# Altium schematic sheet Batarey.SchDoc
size A1; SheetNumber: 1; SheetTotal: 1
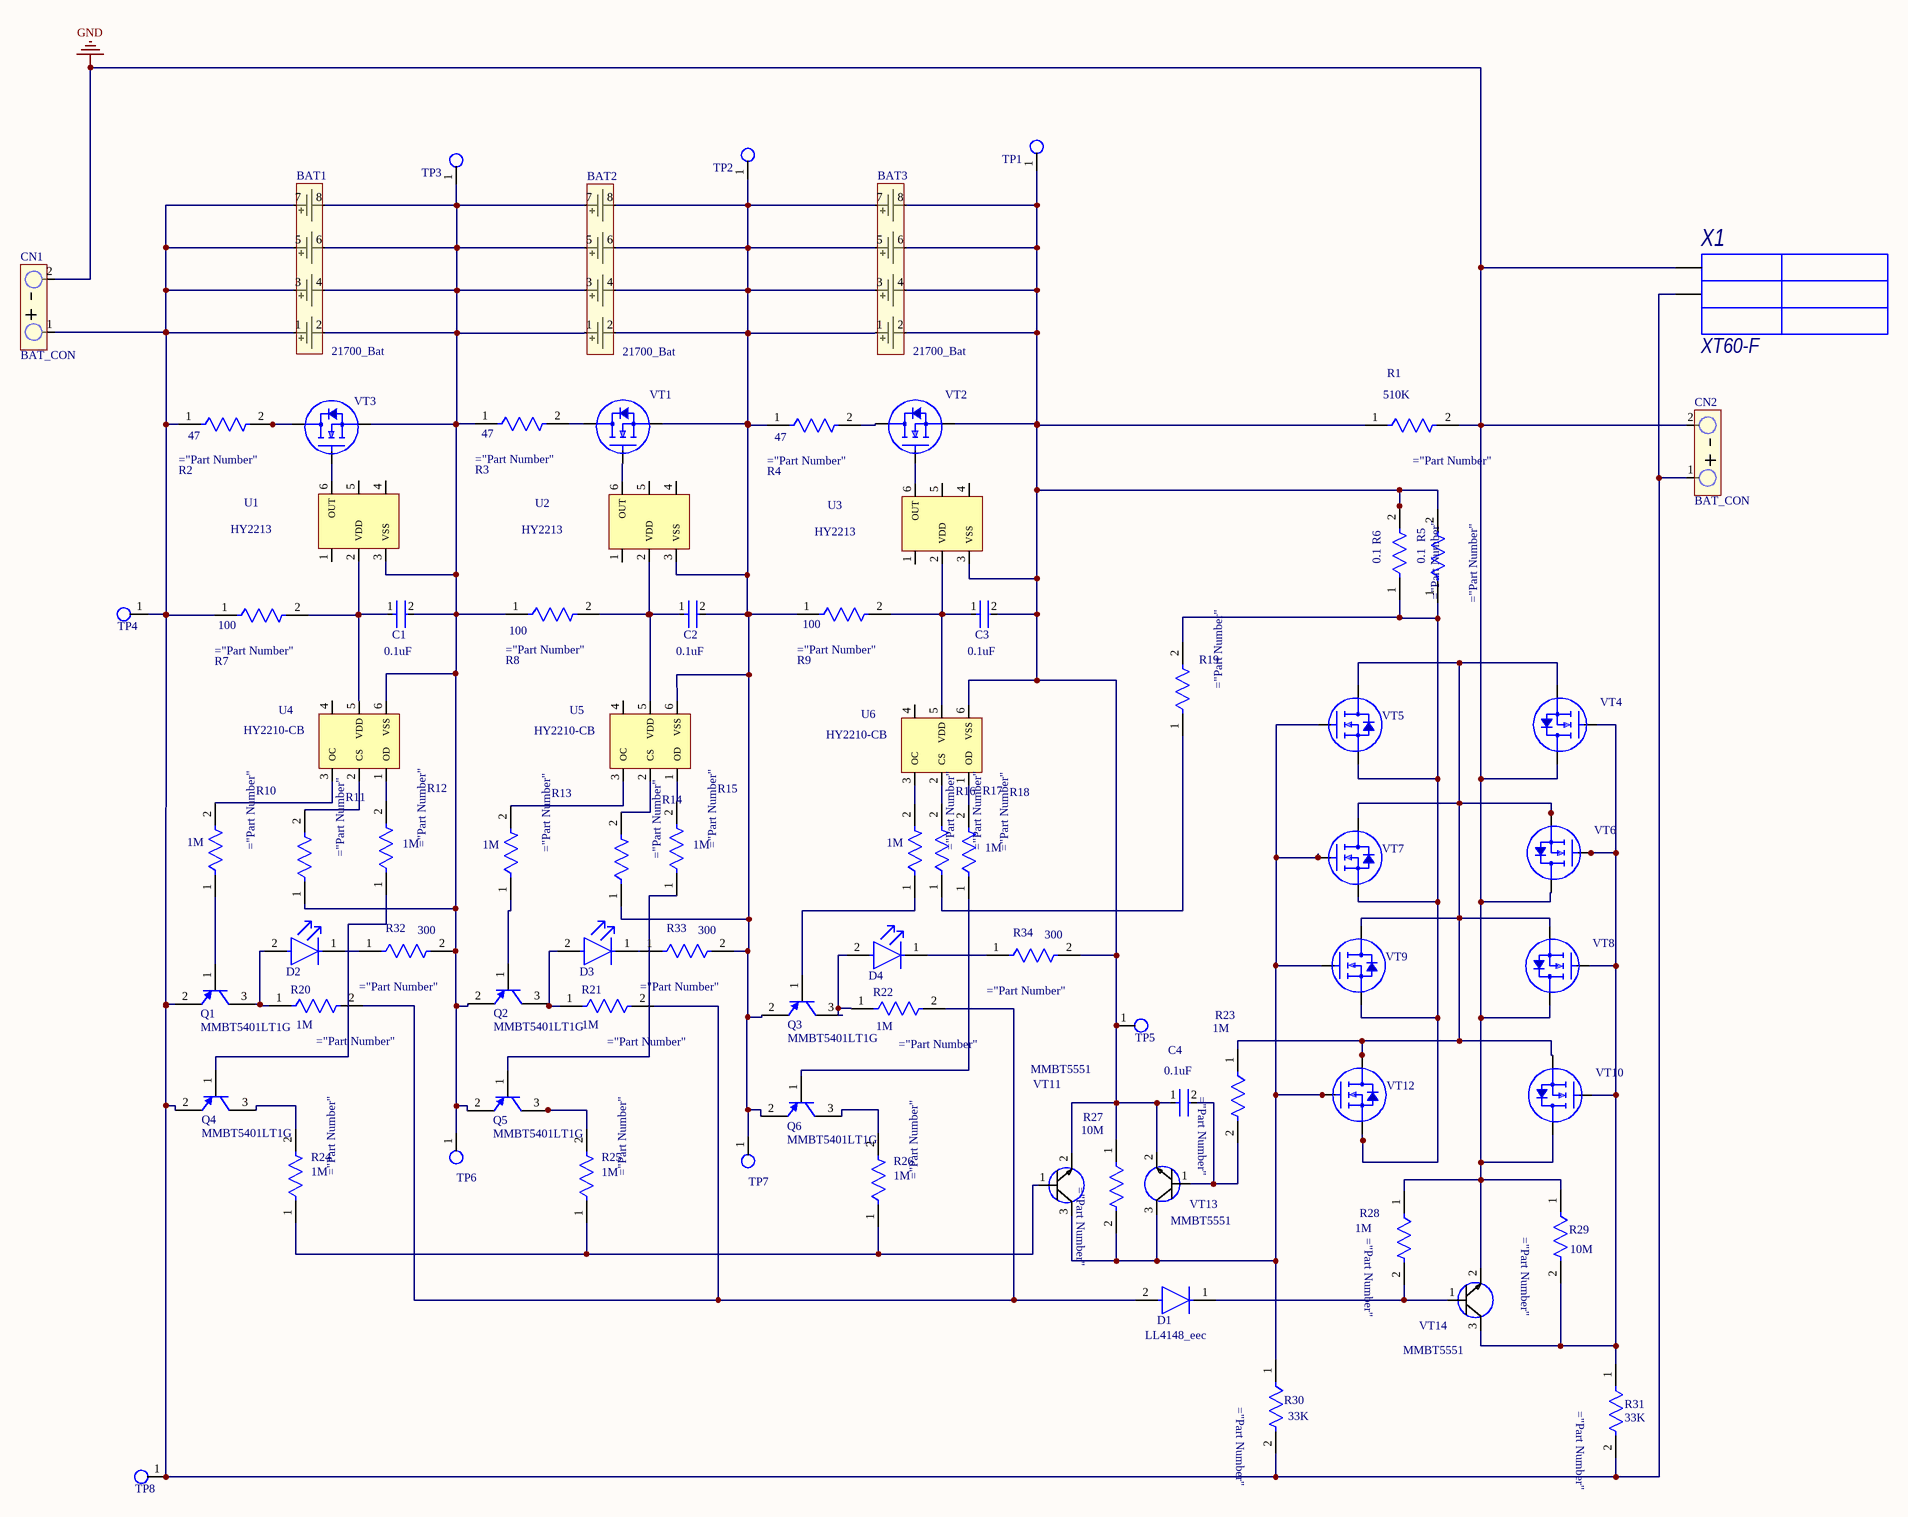
[diagram p0: Batarey.SchDoc]

## Parts
BAT1  21700_Bat  [21700_BAT]
BAT2  21700_Bat  [21700_BAT]
BAT3  21700_Bat  [21700_BAT]
C1  0.1uF  [C-0805]
C2  0.1uF  [C-0805]
C3  0.1uF  [C-0805]
C4  0.1uF  [C-0805]
CN1  BAT_CON  [Batarey_connector]
CN2  BAT_CON  [Batarey_connector]
D1  LL4148_eec  [1N4148WT7]
D2  150080SS75000  [LED-0805B]  (value not drawn)
D3  150080SS75000  [LED-0805B]  (value not drawn)
D4  150080SS75000  [LED-0805B]  (value not drawn)
Q1  MMBT5401LT1G  [ONSC-SOT-23-3-318-08_V]
Q2  MMBT5401LT1G  [ONSC-SOT-23-3-318-08_V]
Q3  MMBT5401LT1G  [ONSC-SOT-23-3-318-08_V]
Q4  MMBT5401LT1G  [ONSC-SOT-23-3-318-08_V]
Q5  MMBT5401LT1G  [ONSC-SOT-23-3-318-08_V]
Q6  MMBT5401LT1G  [ONSC-SOT-23-3-318-08_V]
R1  510K  [R-0805]
R2  47  [TE_Connectivity_CRGCQ1210_IPC_A]
R3  47  [TE_Connectivity_CRGCQ1210_IPC_A]
R4  47  [TE_Connectivity_CRGCQ1210_IPC_A]
R5  0.1  [TE_Connectivity_CRGCQ1210_IPC_A]
R6  0.1  [TE_Connectivity_CRGCQ1210_IPC_A]
R7  100  [TE_Connectivity_CRGCQ1210_IPC_A]
R8  100  [TE_Connectivity_CRGCQ1210_IPC_A]
R9  100  [TE_Connectivity_CRGCQ1210_IPC_A]
R10  1M  [R-0805]
R11  RC0805FR-07100KL  [R-0805]  (value not drawn)
R12  1M  [R-0805]
R13  1M  [R-0805]
R14  RC0805FR-07100KL  [R-0805]  (value not drawn)
R15  1M  [R-0805]
R16  1M  [R-0805]
R17  RC0805FR-07100KL  [R-0805]  (value not drawn)
R18  1M  [R-0805]
R19  1K  [R-0805]  (value not drawn)
R20  1M  [R-0805]
R21  1M  [R-0805]
R22  1M  [R-0805]
R23  1M  [R-0805]
R24  1M  [R-0805]
R25  1M  [R-0805]
R26  1M  [R-0805]
R27  10M  [R-0805]
R28  1M  [R-0805]
R29  10M  [R-0805]
R30  33K  [R-0805]
R31  33K  [R-0805]
R32  300  [R-0805]
R33  300  [R-0805]
R34  300  [R-0805]
TP1  Test_Point_PCB  [TEST_POINT_CONN]  (value not drawn)
TP2  Test_Point_PCB  [TEST_POINT_CONN]  (value not drawn)
TP3  Test_Point_PCB  [TEST_POINT_CONN]  (value not drawn)
TP4  Test_Point_PCB  [TEST_POINT_CONN]  (value not drawn)
TP5  Test_Point_PCB  [TEST_POINT_CONN]  (value not drawn)
TP6  Test_Point_PCB  [TEST_POINT_CONN]  (value not drawn)
TP7  Test_Point_PCB  [TEST_POINT_CONN]  (value not drawn)
TP8  Test_Point_PCB  [TEST_POINT_CONN]  (value not drawn)
U1  HY2213  [HY2213]
U2  HY2213  [HY2213]
U3  HY2213  [HY2213]
U4  HY2210-CB  [HY2213]
U5  HY2210-CB  [HY2213]
U6  HY2210-CB  [HY2213]
VT1  IPB60R600P6  [TO-263-3]  (value not drawn)
VT2  IPB60R600P6  [TO-263-3]  (value not drawn)
VT3  IPB60R600P6  [TO-263-3]  (value not drawn)
VT4  IPB60R600P6  [TO-263-3]  (value not drawn)
VT5  IPB60R600P6  [TO-263-3]  (value not drawn)
VT6  IPB60R600P6  [TO-263-3]  (value not drawn)
VT7  IPB60R600P6  [TO-263-3]  (value not drawn)
VT8  IPB60R600P6  [TO-263-3]  (value not drawn)
VT9  IPB60R600P6  [TO-263-3]  (value not drawn)
VT10  IPB60R600P6  [TO-263-3]  (value not drawn)
VT11  MMBT5551  [On_Semiconductor_318-08_IPC_A]
VT12  IPB60R600P6  [TO-263-3]  (value not drawn)
VT13  MMBT5551  [On_Semiconductor_318-08_IPC_A]
VT14  MMBT5551  [On_Semiconductor_318-08_IPC_A]
X1  XT60-F  [XT60-F AMASS]

## Nets
GND: CN1.2(-) CN2.2(-) R1.2 R28.1 R29.1 VT4.D VT6.D VT8.D VT10.D VT14.2(E) X1.2
NetBAT1_1: BAT1.1(+1S) BAT1.3(+2S) BAT1.5(+3S) BAT1.7(+4S) CN1.1(+) CN2.1(+) Q1.2(E) Q4.2(E) R2.1 R7.1 R30.2 R31.2 TP4.1(G9) TP8.1(G9) X1.1
NetBAT1_2: BAT1.2(-1S) BAT1.4(-2S) BAT1.6(-3S) BAT1.8(-4S) BAT2.1(+1S) BAT2.3(+2S) BAT2.5(+3S) BAT2.7(+4S) C1.2 Q2.2(E) Q5.2(E) R3.1 R8.1 R11.1 R32.2 TP3.1(G9) TP6.1(G9) U1.3(VSS) U4.6(VSS) VT3.S
NetBAT2_2: BAT2.2(-1S) BAT2.4(-2S) BAT2.6(-3S) BAT2.8(-4S) BAT3.1(+1S) BAT3.3(+2S) BAT3.5(+3S) BAT3.7(+4S) C2.2 Q3.2(E) Q6.2(E) R4.1 R9.1 R14.1 R33.2 TP2.1(G9) TP7.1(G9) U2.3(VSS) U5.6(VSS) VT1.S
NetBAT3_2: BAT3.2(-1S) BAT3.4(-2S) BAT3.6(-3S) BAT3.8(-4S) C3.2 C4.1 R1.1 R5.2 R6.2 R27.1 R34.2 TP1.1(G9) TP5.1(G9) U3.3(VSS) U6.6(VSS) VT2.S VT11.2(E) VT13.2(E)
NetC1_1: C1.1 R7.2 U1.2(VDD) U4.5(VDD)
NetC2_1: C2.1 R8.2 U2.2(VDD) U5.5(VDD)
NetC3_1: C3.1 R9.2 U3.2(VDD) U6.5(VDD)
NetC4_2: C4.2 R23.2 VT13.1(B)
NetD1_1: D1.1(C) R28.2 VT14.1(B)
NetD1_2: D1.2(A) R20.2 R21.2 R22.2
NetD2_1: D2.1(C) R32.1
NetD2_2: D2.2(A) Q1.3(C) R20.1
NetD3_1: D3.1(C) R33.1
NetD3_2: D3.2(A) Q2.3(C) R21.1
NetD4_1: D4.1(C) R34.1
NetD4_2: D4.2(A) Q3.3(C) R22.1
NetQ1_1: Q1.1(B) R10.1
NetQ2_1: Q2.1(B) R13.1
NetQ3_1: Q3.1(B) R16.1
NetQ4_1: Q4.1(B) R12.1
NetQ4_3: Q4.3(C) R24.2
NetQ5_1: Q5.1(B) R15.1
NetQ5_3: Q5.3(C) R25.2
NetQ6_1: Q6.1(B) R18.1
NetQ6_3: Q6.3(C) R26.2
NetR2_2: R2.2 VT3.D
NetR3_2: R3.2 VT1.D
NetR4_2: R4.2 VT2.D
NetR5_1: R5.1 R6.1 R19.2 VT5.S VT7.S VT9.S VT12.S
NetR10_2: R10.2 U4.3(OC)
NetR11_2: R11.2 U4.2(CS)
NetR12_2: R12.2 U4.1(OD)
NetR13_2: R13.2 U5.3(OC)
NetR14_2: R14.2 U5.2(CS)
NetR15_2: R15.2 U5.1(OD)
NetR16_2: R16.2 U6.3(OC)
NetR17_1: R17.1 R19.1
NetR17_2: R17.2 U6.2(CS)
NetR18_2: R18.2 U6.1(OD)
NetR23_1: R23.1 VT4.S VT5.D VT6.S VT7.D VT8.S VT9.D VT10.S VT12.D
NetR24_1: R24.1 R25.1 R26.1 VT11.1(B)
NetR27_2: R27.2 R30.1 VT5.G VT7.G VT9.G VT11.3(C) VT12.G VT13.3(C)
NetR29_2: R29.2 R31.1 VT4.G VT6.G VT8.G VT10.G VT14.3(C)
NetU1_6: U1.6(OUT) VT3.G
NetU2_6: U2.6(OUT) VT1.G
NetU3_6: U3.6(OUT) VT2.G

Not connected (* = marked no-connect by the designer): U1 1(47) 4 5; U2 1(47) 4 5; U3 1(47) 4 5; U4 4; U5 4; U6 4

## Library data of the parts
C1-C4 = C0805C224K5RACTU
CN1 CN2 = BAT_CON: Batarey_connection
D1 = Diode_Fairchild-ON_Semiconductor_LL4148_eec: DIODE GEN PURP 100V 200MA SOD80; Part Number: LL4148; Manufacturer: Fairchild/ON Semiconductor; Num Pins: 2; helpURL: https://upverter.com/upn/revision/7267ed481d20a817/; ComponentLink2Description: Datasheet; Temperature: -55°C to +175°C; Package: SOD80; Supplier 2: Mouser; Price: 0.0408687939508; Supplier 1: Digi-Key; ComponentLink1URL: https://upverter.com/upn/revision/7267ed481d20a817/; Supplier Part Number 2: 512-LL4148; Supplier Part Number 1: LL4148FSCT-ND; ComponentLink1Description: Upverter; ComponentLink2URL: https://www.fairchildsemi.com/datasheets/LL/LL4148.pdf; RoHS: TRUE; Mouser Part Number: 512-LL4148; Temperature Range High: +175°C; Digikey Description: DIODE GEN PURP 100V 200MA SOD80; Digikey Part Number: LL4148FSCT-ND; Lead Free: yes; Temperature Range Low: -55°C
Q1-Q6 = MMBT5401LT1G: High Voltage Transistor, PNP Silicon, 3-Pin SOT-23, Pb-Free, Tape and Reel; Manufacturer: On Semiconductor; fT Min (MHz): 100; IC Continuous (A): -0.5; Polarity: PNP; ComponentLink1Description: Manufacturer URL; ComponentLink2Description: Datasheet; PartNumber: MMBT5401LT1G; ComponentLink3Description: Package Specification; Mounting Technology: Surface Mount; ComponentLink3URL: http://www.onsemi.cn/pub_link/Collateral/318-08.PDF; DatasheetVersion: Rev. 11; ComponentLink1URL: http://www.onsemi.com/; Packing: Tape and Reel; PackageVersion: Rev. AP, 11/2009; PackageReference: SOT-23-3-318-08; PackageDescription: 3-Pin Small Outline Transistor, Body 2.92 x 1.3 mm, Pitch 0.95 mm; ComponentLink2URL: http://www.onsemi.cn/pub_link/Collateral/MMBT5401LT1-D.PDF; RoHS: TRUE
R1 R10 R12 R13 R15 R16 R18-R31 = RC0805FR-07100KL
R2-R9 R32-R34 = CRGCQ1210F2K7
TP1-TP8 = TP_PCB?: Test_Point
VT1-VT3 VT6 VT8-VT10 VT12 = IPB60R600P6: Транзистор МОП, одиночный, N-канальный; pin to pad: D>2 G>1 S>3; ComponentDescription: =ComponentType+', '+ChannelType+', '+Comment+', '+Package; ChannelType: N-канальный; ComponentType: Транзистор МОП, одиночный; Package: TO-263-3
VT4 VT5 VT7 = IPB60R600P6: Транзистор МОП, одиночный, N-канальный; ComponentDescription: =ComponentType+', '+ChannelType+', '+Comment+', '+Package; ChannelType: N-канальный; ComponentType: Транзистор МОП, одиночный; Package: TO-263-3
X1 = XT60-F: Разъем; ComponentDescription: Разъём, XT60-F; ComponentTypе: Разъём